# EAGLE design Controller (EAGLE 8.5.1)
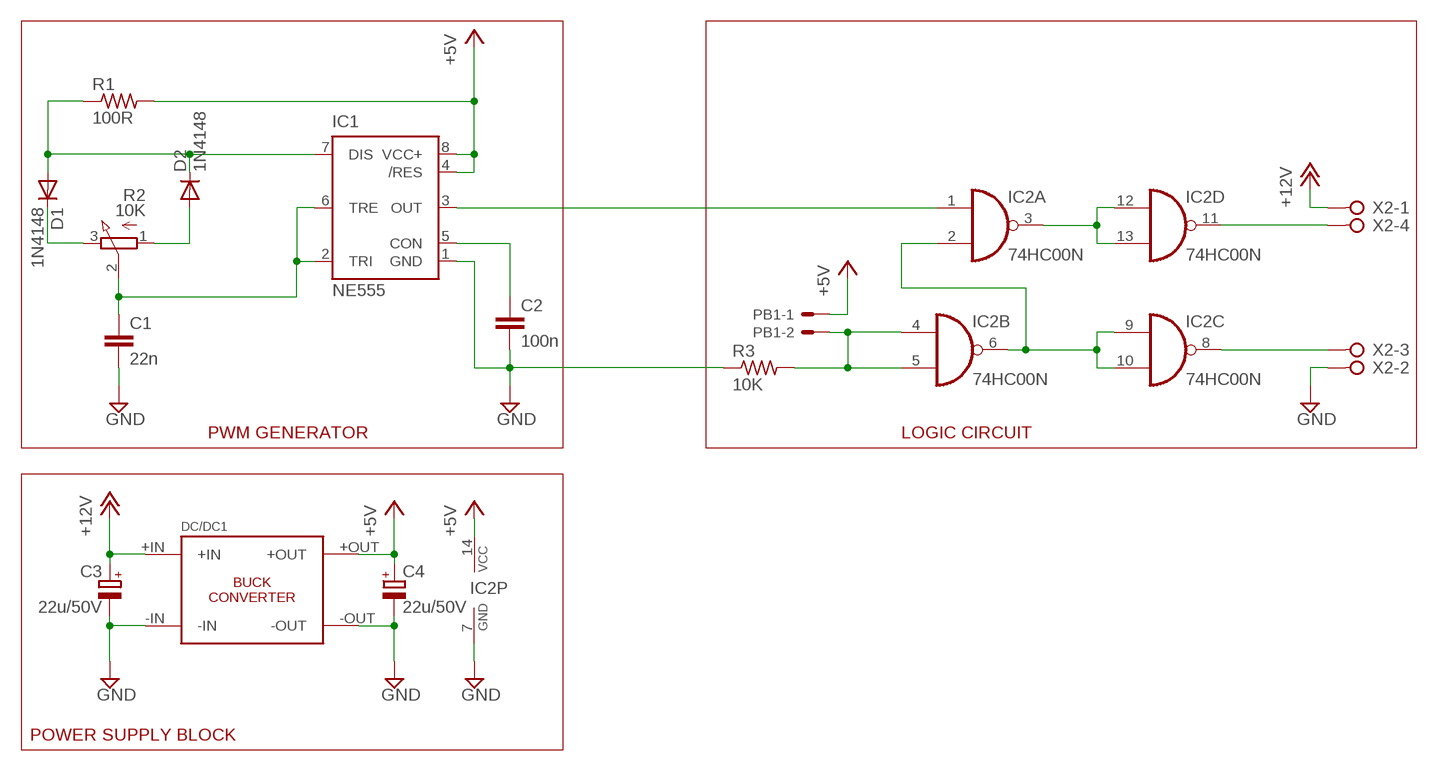
[diagram p0: schematic, sheet 1]

## Parts
C1  22n  C-EU050-035X075  [C050-035X075]
C2  100n  C-EU075-032X103  [C075-032X103]
C3  22u/50V  CPOL-EUE2.5-6  [E2,5-6]
C4  22u/50V  CPOL-EUE2.5-6  [E2,5-6]
D1  1N4148  [DO35-10]
D2  1N4148  [DO35-10]
DC/DC1  MP1548EN  [MP1548EN]
IC1  NE555  [DIL-08]
IC2  74HC00N  [DIL14]
PB1  22-23-2021  [22-23-2021]
R1  100R  R-US_0207/12  [0207/12]
R2  10K  3RP/1610N  [3RP/1610N]
R3  10K  R-US_0207/12  [0207/12]
X2  W237-04P  [W237-4P]

## Nets
+5V: C4.+ DC/DC1.+OUT IC1.4(/RES) IC1.8(VCC+) IC2.14(P:VCC) PB1.1 R1.2
+12V: C3.+ DC/DC1.+IN X2.1
GND: C1.2 C2.2 C3.- C4.- DC/DC1.-IN DC/DC1.-OUT IC1.1(GND) IC2.7(P:GND) R3.1 X2.2
N$1: C1.1 IC1.2(TRI) IC1.6(TRE) R2.2(S)
N$2: IC1.3(OUT) IC2.1(A:I0)
N$3: D1.C R2.3(E)
N$4: D2.A R2.1(A)
N$5: D1.A D2.C IC1.7(DIS) R1.1
N$6: IC2.8(C:O) X2.3
N$7: IC2.3(A:O) IC2.12(D:I0) IC2.13(D:I1)
N$8: C2.1 IC1.5(CON)
N$9: IC2.2(A:I1) IC2.6(B:O) IC2.9(C:I0) IC2.10(C:I1)
N$10: IC2.11(D:O) X2.4
N$12: IC2.4(B:I0) IC2.5(B:I1) PB1.2 R3.2

## Notes on the sheet
- PWM GENERATOR | LOGIC CIRCUIT
- POWER SUPPLY BLOCK

## Library data of the parts
C1 C2 = rcl:C-EU: CAPACITOR, European symbol
C3 C4 = rcl:CPOL-EU: POLARIZED CAPACITOR, European symbol
D1 D2 = diode:1N4148: DIODE high speed (Philips)
DC/DC1 = DC-DC Modulan XL4005:MP1548EN
IC1 = st-microelectronics:NE555: General purpose bipolar Timer; MF: Arrow Electronics; MPN: NE555N; OC_FARNELL: 1467742; OC_NEWARK: 89K1486
IC2 = 74xx-eu:74*00: Quad 2-input NAND gate
PB1 = con-molex:22-23-2021: .100" (2.54mm) Center Header - 2 Pin; MF: MOLEX; MPN: 22-23-2021; OC_FARNELL: 1462926; OC_NEWARK: 25C3832
R1 R3 = resistor:R-US_: RESISTOR, American symbol
R2 = pot:3RP/1610N: 16mm Potentiometer one level Source: http://www.alphapotentiometers.net/html/16mm_pot_2.html
X2 = con-wago-508:W237-04P: WAGO SREW CLAMP; OC_FARNELL: unknown; OC_NEWARK: unknown

## Board
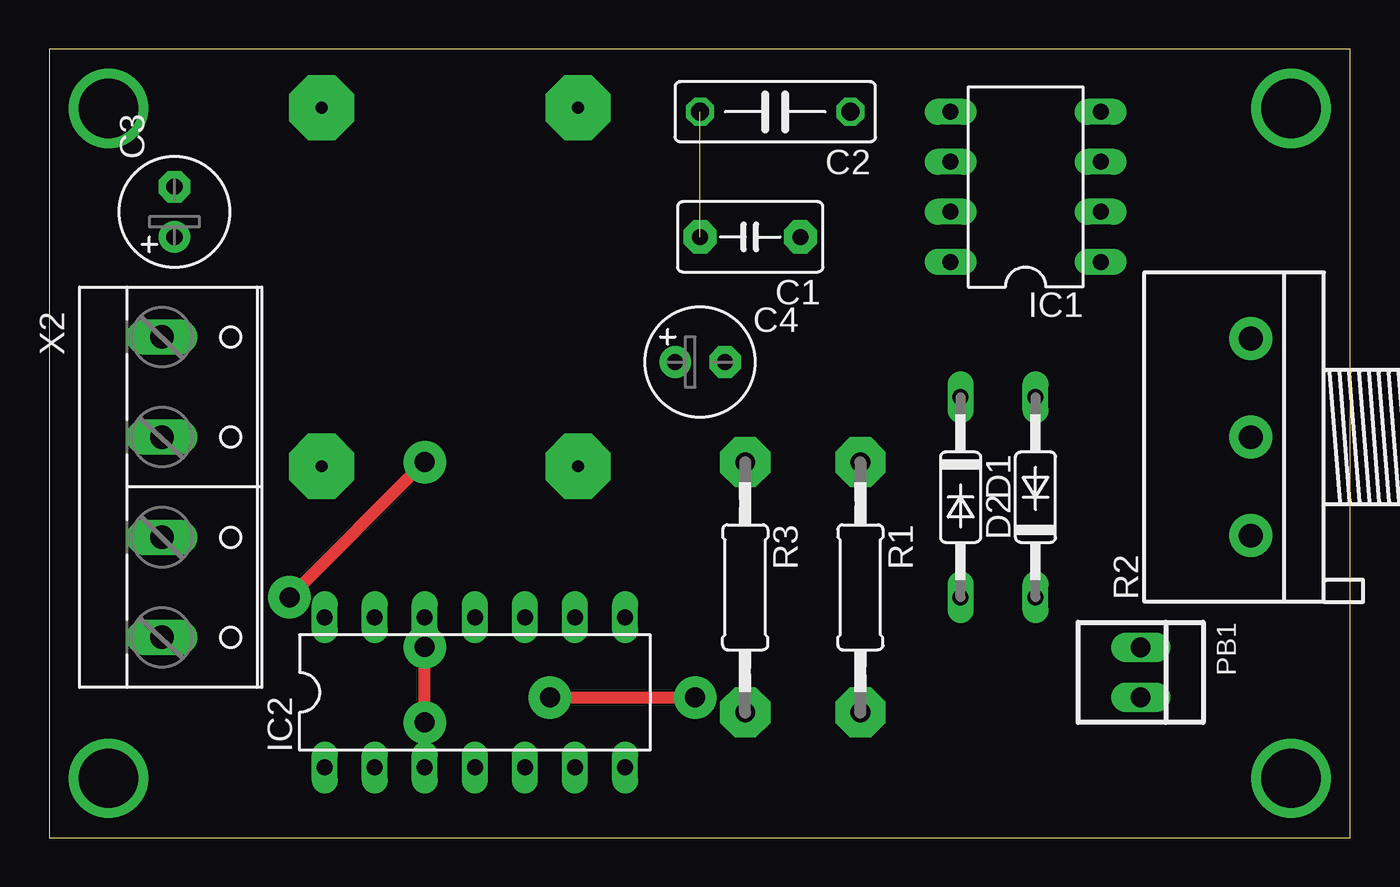
[diagram p1: board, top side]
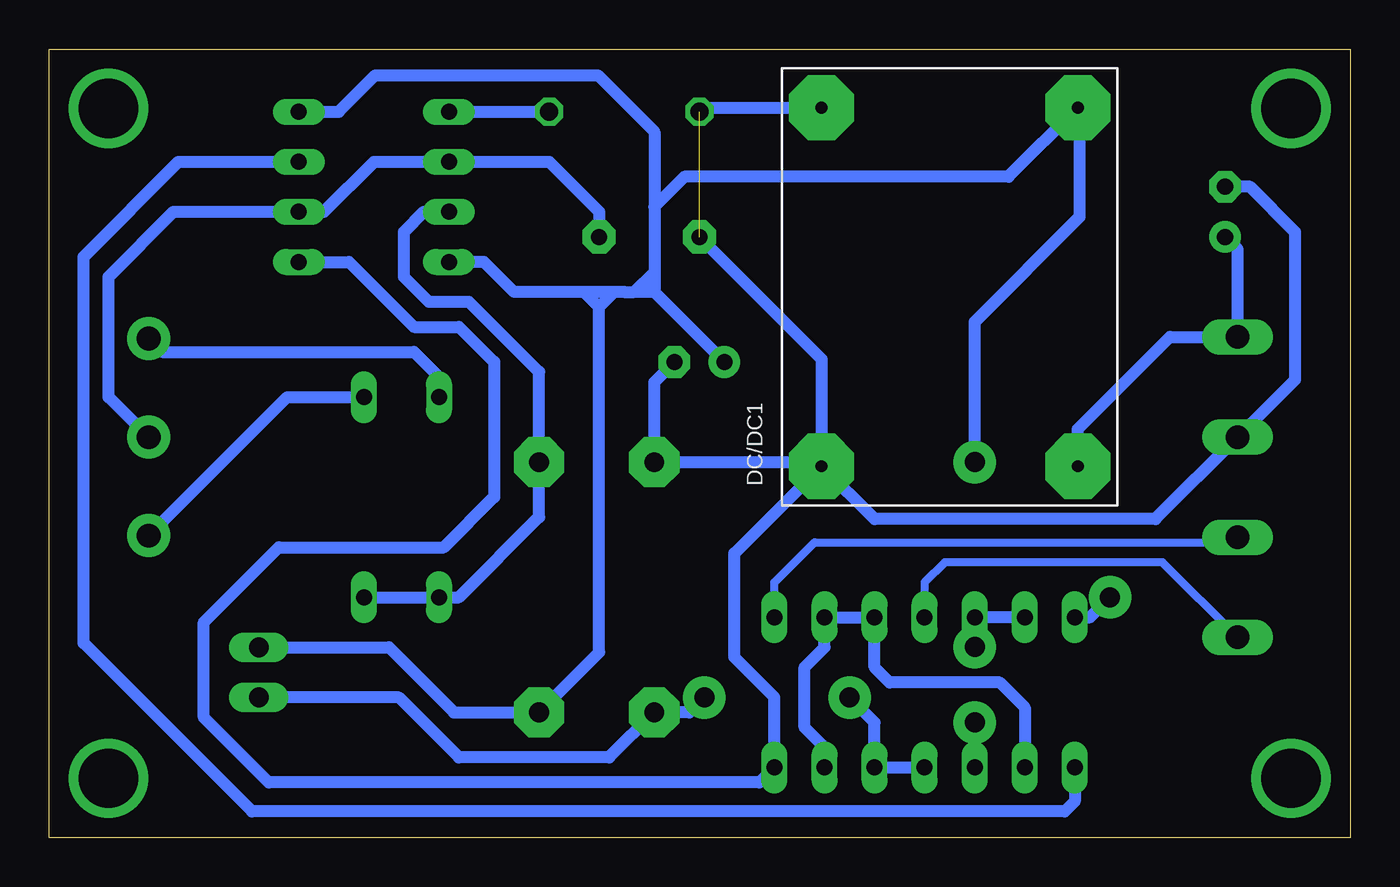
[diagram p2: board, bottom side, seen from below]

Size 66 x 40 mm. Coordinates in mm from the lower left corner, seen from the top.
Outline: 0,0 66,0 66,40 0,40 0,0
Copper layers (1*16): Top 0.035mm / dielectric 1.5mm / Bottom 0.035mm
Design rules "default *": minimum track width 16mil, minimum drill 0.35mm, track to track 16mil, track to pad 16mil, pad to pad 16mil, via to via 16mil, smd to smd 16mil, copper to edge 40mil, drill to drill 6mil, minimum pad ring 10mil, minimum via ring 8mil, stop-mask expansion 4mil, vias tented up to drill 0mil, thermal gap 10mil

### Footprints (pad centres in the part's own frame; a part is rotated, then mirrored left to right if it is on the bottom)
C050-035X075 = drill 0.813 pad 1.676 octagon: 1 -2.54,0; 2 2.54,0
C075-032X103 = drill 0.914 octagon: 1 -3.81,0; 2 3.81,0
E2,5-6 = drill 0.813 pad 1.6: + -1.27,0 | drill 0.813 pad 1.6 octagon: - 1.27,0
DO35-10 = drill 0.813 long: A 5.08,0; C -5.08,0
MP1548EN = drill 0.6 pad 3.3 octagon: +IN -9.1,-6.5; +OUT 9.1,-6.5; -IN -9.1,6.5; -OUT 9.1,6.5
DIL-08 = drill 0.813 long: 1 -3.81,-3.81; 2 -1.27,-3.81; 3 1.27,-3.81; 4 3.81,-3.81; 5 3.81,3.81; 6 1.27,3.81; 7 -1.27,3.81; 8 -3.81,3.81
DIL14 = drill 0.813 long: 1 -7.62,-3.81; 2 -5.08,-3.81; 3 -2.54,-3.81; 4 0,-3.81; 5 2.54,-3.81; 6 5.08,-3.81; 7 7.62,-3.81; 8 7.62,3.81; 9 5.08,3.81; 10 2.54,3.81; 11 0,3.81; 12 -2.54,3.81; 13 -5.08,3.81; 14 -7.62,3.81
22-23-2021 = drill 1 long: 1 -1.27,0; 2 1.27,0
0207/12 = drill 1 pad 2.54 octagon: 1 -6.35,0; 2 6.35,0
3RP/1610N = drill 1.2 pad 2.184: 1 -5,0; 2 0,0; 3 5,0
W237-4P = drill 1.194 long: 1 -7.62,-0.635; 2 -2.54,-0.635; 3 2.54,-0.635; 4 7.62,-0.635

### Placement (x,y rotation side)
C1  35.56,30.48 180 top
C2  36.83,36.83 180 top
C3  6.35,31.75 90 top
C4  33.02,24.13 0 top
D1  46.23,17.27 270 top
D2  50.04,17.27 90 top
DC/DC1  20.32,27.94 90 bottom
IC1  49.53,33.02 90 top
IC2  21.59,7.37 0 top
PB1  55.37,8.38 270 top
R1  41.15,12.7 270 top
R2  60.96,20.32 90 top
R3  35.31,12.7 270 top
X2  6.35,17.78 270 top

### Tracks (layer width: path | path; a pad name or v marks a point on that pad's centre or on a via)
+5V  (via drill 1.02 pad 2.16)
  Top 0.61: v12.19,12.19 v19.05,19.05
  Bottom 0.61: C4.+ 35.31,27.69 | IC1.8 43.94,29.21 42.42,27.69 38.86,27.69 | 35.31,27.69 36.32,27.69 | 37.34,27.69 36.83,27.69 36.32,27.69 | 37.34,27.69 38.86,27.69 | IC2.14 13.21,11.18 v12.19,12.19 | v19.05,19.05 19.05,26.16 13.72,31.5 13.72,36.94 DC/DC1.+OUT 17.33,33.53 33.78,33.53 35.31,32 | 35.31,32 35.31,28.7 | 35.31,28.7 35.31,27.69 | IC1.4 51.31,36.83 49.46,38.68 38.17,38.68 35.31,35.81 35.31,32 | PB1.1 48.77,9.65 45.47,6.35 R1.2 38.1,9.4 38.1,26.92 | 38.1,26.92 37.34,27.69 | 38.1,26.92 38.86,27.69 | 36.32,27.69 35.31,28.7
+12V
  Bottom 0.61: DC/DC1.+IN 13.82,20.72 9.14,25.4 X2.1 5.71,29.84 C3.+
GND  (1 unrouted)
  Bottom 0.61: C3.- 5.08,33.02 2.79,30.73 2.79,23.24 X2.2 9.88,16.15 24.13,16.15 DC/DC1.-IN | DC/DC1.-IN 31.24,14.42 31.24,9.14 29.21,7.11 IC2.7 29.97,2.79 54.86,2.79 58.17,6.1 58.17,10.92 54.36,14.73 45.97,14.73 43.43,17.27 43.43,24.13 45.21,25.91 47.5,25.91 50.8,29.21 IC1.1 | DC/DC1.-IN 27.03,19.05 R3.1 35.31,23.11 C4.- | C1.2 26.82,24.28 DC/DC1.-IN | C2.2 32.81,37.04 DC/DC1.-OUT
N$1
  Bottom 0.61: C1.1 38.1,31.75 40.64,34.29 IC1.6 49.53,34.29 52.07,31.75 52.83,31.75 IC1.2 59.69,31.75 62.99,28.45 62.99,22.35 R2.2
N$2
  Bottom 0.61: IC2.1 13.97,1.83 14.48,1.32 55.71,1.32 64.26,9.87 64.26,29.46 59.44,34.29 IC1.3
N$3
  Bottom 0.61: R2.3 60.28,24.64 47.5,24.64 46.23,23.37 D1.C
N$4
  Bottom 0.61: R2.1 53.93,22.35 D2.A
N$5
  Bottom 0.61: IC1.7 46.99,31.75 48.01,30.73 48.01,28.45 46.74,27.18 44.7,27.18 41.15,23.62 R1.1 41.15,16.26 45.21,12.19 D1.A D2.C
N$6
  Bottom 0.406: IC2.8 29.21,12.95 27.18,14.99 5.97,14.99 X2.3
N$7  (via drill 1.02 pad 2.16)
  Top 0.61: v19.05,5.84 v19.05,9.66
  Bottom 0.61: IC2.3 v19.05,5.84 | v19.05,9.66 IC2.12 IC2.13
N$8
  Bottom 0.61: IC1.5 C2.1
N$9
  Bottom 0.61: IC2.6 26.67,4.57 27.69,5.59 27.69,8.64 26.67,9.65 IC2.9 IC2.10 24.13,8.64 23.37,7.87 17.78,7.87 16.51,6.6 IC2.2
N$10
  Bottom 0.406: X2.4 9.53,13.97 20.57,13.97 21.59,12.95 IC2.11
N$11  (via drill 3 pad 2.16)
  other vias: 3,3
N$12  (via drill 1.02 pad 2.16)
  Top 0.61: v25.4,7.11 v32.77,7.11
  Bottom 0.61: IC2.4 IC2.5 24.13,5.84 v25.4,7.11 | v32.77,7.11 33.53,6.35 R3.2 37.59,4.06 45.21,4.06 48.26,7.11 PB1.2
N$13  (via drill 3 pad 2.16)
  other vias: 3,37
N$14  (via drill 3 pad 2.16)
  other vias: 63,37
N$15  (via drill 3 pad 2.16)
  other vias: 63,3